# EAGLE design DAC (EAGLE 7.2.0)
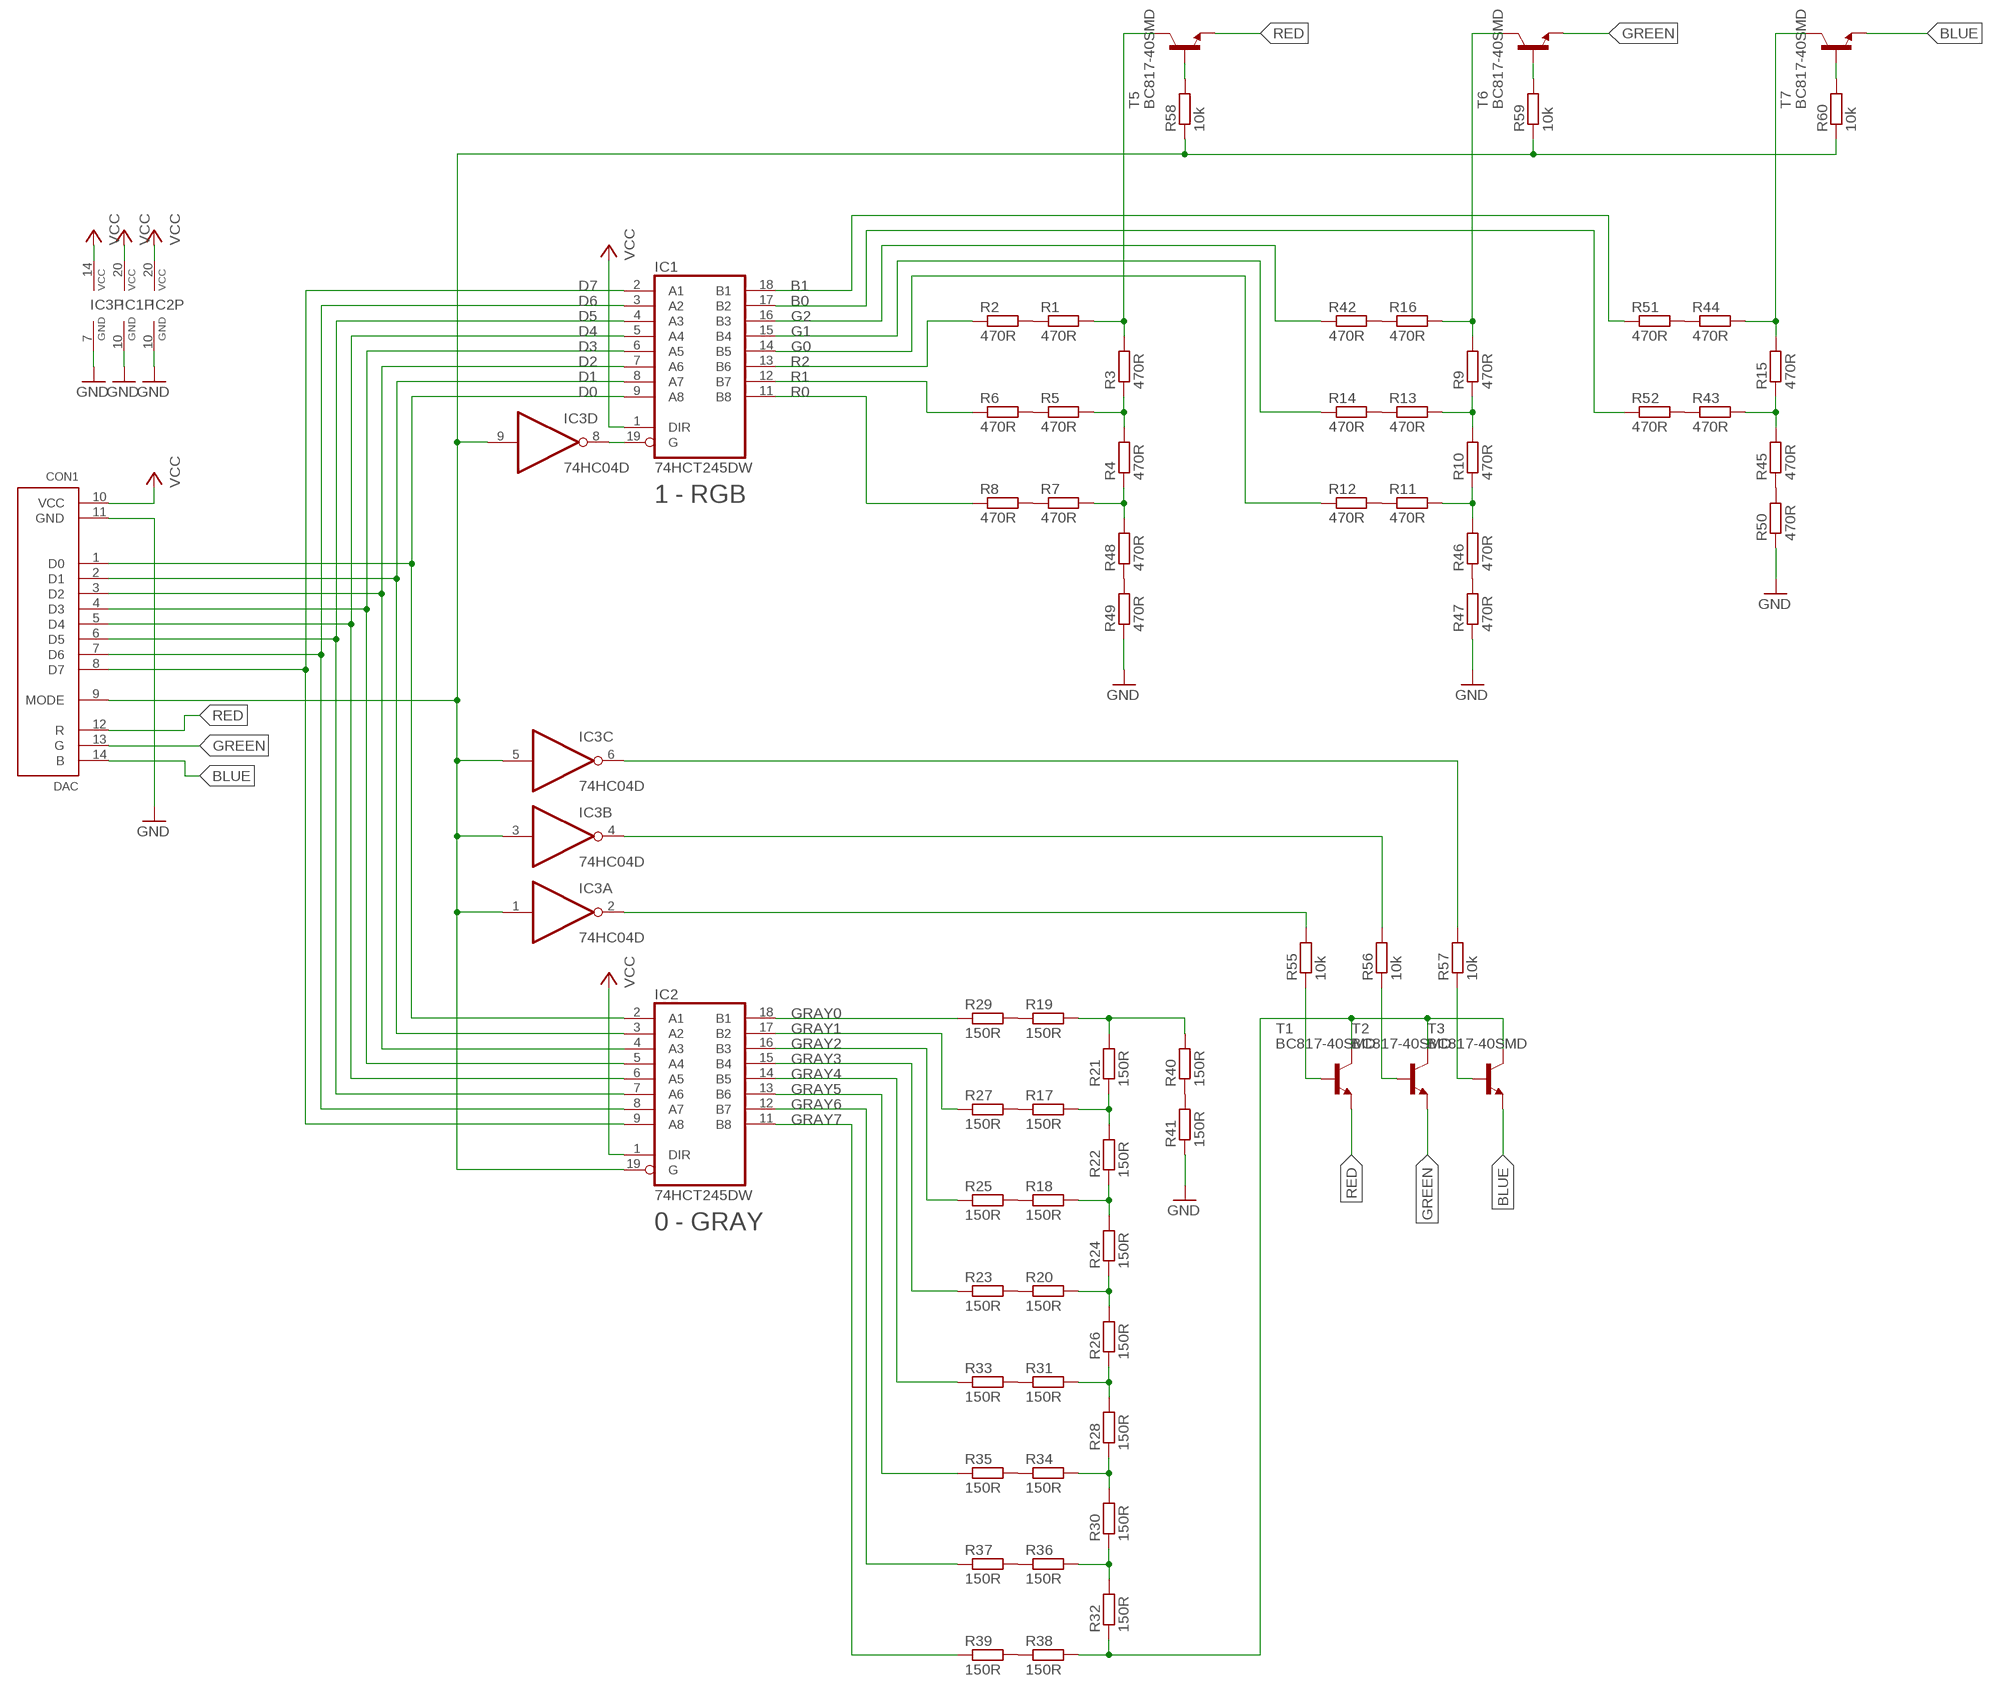
[diagram p0: schematic, sheet 1]

## Parts
CON1  DAC  [DAC_CON]
IC1  74HCT245DW  [SO20W]
IC2  74HCT245DW  [SO20W]
IC3  74HC04D  [SO14]
R1  470R  R-EU_R0603  [R0603]
R2  470R  R-EU_R0603  [R0603]
R3  470R  R-EU_R0603  [R0603]
R4  470R  R-EU_R0603  [R0603]
R5  470R  R-EU_R0603  [R0603]
R6  470R  R-EU_R0603  [R0603]
R7  470R  R-EU_R0603  [R0603]
R8  470R  R-EU_R0603  [R0603]
R9  470R  R-EU_R0603  [R0603]
R10  470R  R-EU_R0603  [R0603]
R11  470R  R-EU_R0603  [R0603]
R12  470R  R-EU_R0603  [R0603]
R13  470R  R-EU_R0603  [R0603]
R14  470R  R-EU_R0603  [R0603]
R15  470R  R-EU_R0603  [R0603]
R16  470R  R-EU_R0603  [R0603]
R17  150R  R-EU_R0603  [R0603]
R18  150R  R-EU_R0603  [R0603]
R19  150R  R-EU_R0603  [R0603]
R20  150R  R-EU_R0603  [R0603]
R21  150R  R-EU_R0603  [R0603]
R22  150R  R-EU_R0603  [R0603]
R23  150R  R-EU_R0603  [R0603]
R24  150R  R-EU_R0603  [R0603]
R25  150R  R-EU_R0603  [R0603]
R26  150R  R-EU_R0603  [R0603]
R27  150R  R-EU_R0603  [R0603]
R28  150R  R-EU_R0603  [R0603]
R29  150R  R-EU_R0603  [R0603]
R30  150R  R-EU_R0603  [R0603]
R31  150R  R-EU_R0603  [R0603]
R32  150R  R-EU_R0603  [R0603]
R33  150R  R-EU_R0603  [R0603]
R34  150R  R-EU_R0603  [R0603]
R35  150R  R-EU_R0603  [R0603]
R36  150R  R-EU_R0603  [R0603]
R37  150R  R-EU_R0603  [R0603]
R38  150R  R-EU_R0603  [R0603]
R39  150R  R-EU_R0603  [R0603]
R40  150R  R-EU_R0603  [R0603]
R41  150R  R-EU_R0603  [R0603]
R42  470R  R-EU_R0603  [R0603]
R43  470R  R-EU_R0603  [R0603]
R44  470R  R-EU_R0603  [R0603]
R45  470R  R-EU_R0603  [R0603]
R46  470R  R-EU_R0603  [R0603]
R47  470R  R-EU_R0603  [R0603]
R48  470R  R-EU_R0603  [R0603]
R49  470R  R-EU_R0603  [R0603]
R50  470R  R-EU_R0603  [R0603]
R51  470R  R-EU_R0603  [R0603]
R52  470R  R-EU_R0603  [R0603]
R55  10k  R-EU_R0603  [R0603]
R56  10k  R-EU_R0603  [R0603]
R57  10k  R-EU_R0603  [R0603]
R58  10k  R-EU_R0603  [R0603]
R59  10k  R-EU_R0603  [R0603]
R60  10k  R-EU_R0603  [R0603]
T1  BC817-40SMD  [SOT23-BEC]
T2  BC817-40SMD  [SOT23-BEC]
T3  BC817-40SMD  [SOT23-BEC]
T5  BC817-40SMD  [SOT23-BEC]
T6  BC817-40SMD  [SOT23-BEC]
T7  BC817-40SMD  [SOT23-BEC]

## Nets
B0: IC1.17(B2) R52.1
B1: IC1.18(B1) R51.1
BLUE: CON1.14(B) T3.E T7.E
D0: CON1.1(D0) IC1.9(A8) IC2.2(A1)
D1: CON1.2(D1) IC1.8(A7) IC2.3(A2)
D2: CON1.3(D2) IC1.7(A6) IC2.4(A3)
D3: CON1.4(D3) IC1.6(A5) IC2.5(A4)
D4: CON1.5(D4) IC1.5(A4) IC2.6(A5)
D5: CON1.6(D5) IC1.4(A3) IC2.7(A6)
D6: CON1.7(D6) IC1.3(A2) IC2.8(A7)
D7: CON1.8(D7) IC1.2(A1) IC2.9(A8)
DAC_BLUE: R15.2 R44.2 T7.C
DAC_GRAY: R32.1 R38.2 T1.C T2.C T3.C
DAC_GREEN: R9.2 R16.2 T6.C
DAC_RED: R1.2 R3.2 T5.C
G0: IC1.14(B5) R12.1
G1: IC1.15(B4) R14.1
G2: IC1.16(B3) R42.1
GND: CON1.11(GND) IC1.10(GND) IC2.10(GND) IC3.7(P:GND) R41.1 R47.1 R49.1 R50.1
GRAY0: IC2.18(B1) R29.1
GRAY1: IC2.17(B2) R27.1
GRAY2: IC2.16(B3) R25.1
GRAY3: IC2.15(B4) R23.1
GRAY4: IC2.14(B5) R33.1
GRAY5: IC2.13(B6) R35.1
GRAY6: IC2.12(B7) R37.1
GRAY7: IC2.11(B8) R39.1
GREEN: CON1.13(G) T2.E T6.E
N$1: R9.1 R10.2 R13.2
N$2: R3.1 R4.2 R5.2
N$3: R4.1 R7.2 R48.2
N$4: R10.1 R11.2 R46.2
N$5: R15.1 R43.2 R45.2
N$6: R20.1 R23.2
N$7: R17.2 R21.1 R22.2
N$8: R18.2 R22.1 R24.2
N$9: R20.2 R24.1 R26.2
N$10: R26.1 R28.2 R31.2
N$11: R28.1 R30.2 R34.2
N$12: R30.1 R32.2 R36.2
N$14: R18.1 R25.2
N$15: R17.1 R27.2
N$16: R19.1 R29.2
N$17: R31.1 R33.2
N$18: R34.1 R35.2
N$19: R36.1 R37.2
N$20: R38.1 R39.2
N$21: R40.1 R41.2
N$22: R1.1 R2.2
N$23: R5.1 R6.2
N$24: R7.1 R8.2
N$25: R11.1 R12.2
N$26: R13.1 R14.2
N$27: R16.1 R42.2
N$28: R46.1 R47.2
N$29: R48.1 R49.2
N$30: R45.1 R50.2
N$31: R44.1 R51.2
N$32: R43.1 R52.2
N$33: R19.2 R21.2 R40.2
N$49: IC1.19(G) IC3.8(D:O)
N$50: IC3.2(A:O) R55.2
N$51: R58.2 T5.B
N$52: IC3.4(B:O) R56.2
N$53: R59.2 T6.B
N$54: R55.1 T1.B
N$55: R56.1 T2.B
N$56: R57.1 T3.B
N$57: R60.2 T7.B
N$58: CON1.9(MODE) IC2.19(G) IC3.1(A:I) IC3.3(B:I) IC3.5(C:I) IC3.9(D:I) R58.1 R59.1 R60.1
N$59: IC3.6(C:O) R57.2
R0: IC1.11(B8) R8.1
R1: IC1.12(B7) R6.1
R2: IC1.13(B6) R2.1
RED: CON1.12(R) T1.E T5.E
VCC: CON1.10(VCC) IC1.1(DIR) IC1.20(VCC) IC2.1(DIR) IC2.20(VCC) IC3.14(P:VCC)
Unconnected: IC3.10(E:O) IC3.11(E:I) IC3.12(F:O) IC3.13(F:I)

## Notes on the sheet
- 1 - RGB
- 0 - GRAY

## Library data of the parts
CON1 = DAC connector:DAC
IC1 IC2 = 74xx-eu:74*245: Octal BUS TRANSCEIVER, 3-state
IC3 = 74xx-eu:74*04: Hex INVERTER
R1-R52 R55-R60 = rcl:R-EU_: RESISTOR, European symbol
T1-T3 T5-T7 = transistor-npn:BC817*: NPN Transistor

## Board
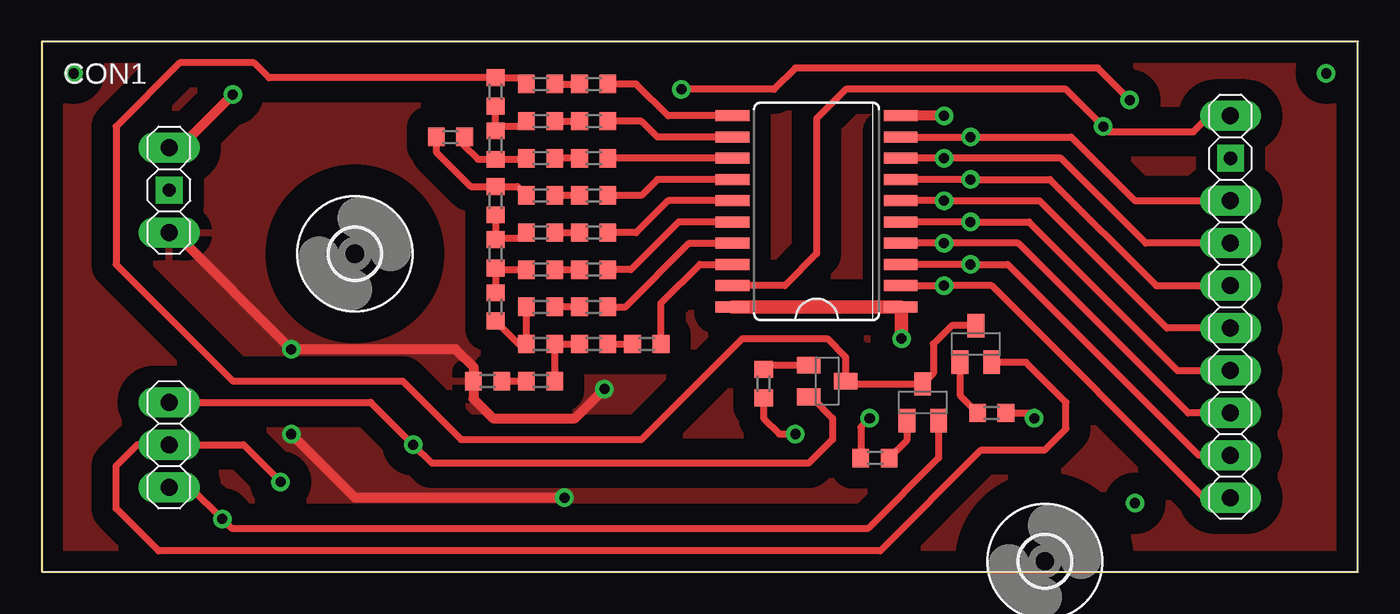
[diagram p1: board, top side]
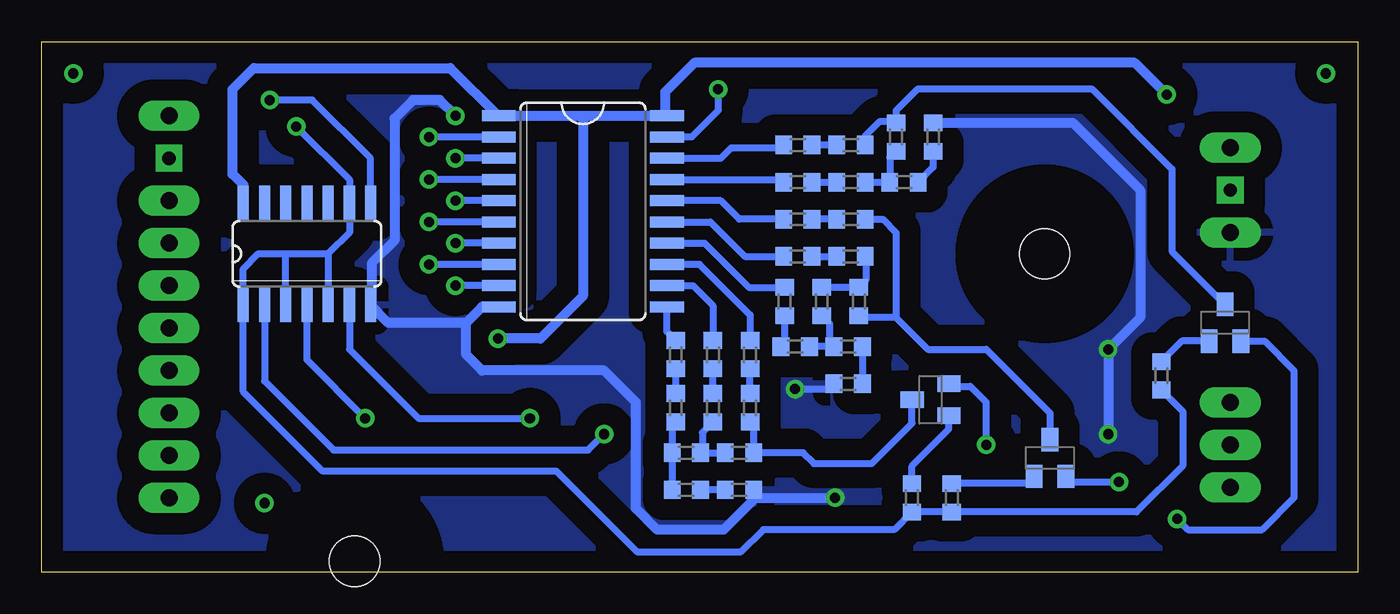
[diagram p2: board, bottom side, seen from below]

Size 78.73 x 31.74 mm. Coordinates in mm from the lower left corner, seen from the top.
Outline: 0,0 78.73,0 78.73,31.74 0,31.74 0,0
Copper layers (1*16): Top 0.035mm / dielectric 1.5mm / Bottom 0.035mm
Design rules "Aroidzap_DesignRules20mil": minimum track width 16mil, minimum drill 0.6mm, track to track 20mil, track to pad 20mil, pad to pad 20mil, via to via 20mil, smd to smd 16mil, copper to edge 20mil, drill to drill 40mil, minimum pad ring 16mil, minimum via ring 10mil, stop-mask expansion 4mil, vias tented up to drill 0mil, thermal gap 30mil

### Footprints (pad centres in the part's own frame; a part is rotated, then mirrored left to right if it is on the bottom)
DAC_CON = drill 1.016 long: 1 31.75,-11.43; 2 31.75,-8.89; 3 31.75,-6.35; 4 31.75,-3.81; 5 31.75,-1.27; 6 31.75,1.27; 7 31.75,3.81; 8 31.75,6.35; 9 31.75,11.43; 10 -31.75,9.525; 11 -31.75,4.445; 12 -31.75,-5.715; 13 -31.75,-8.255; 14 -31.75,-10.795 | drill 0.8 square: NC1 31.75,8.89; NC2 -31.75,6.985
SO20W = smd 0.66 x 2.032: 1 -5.715,-5.029; 2 -4.445,-5.029; 3 -3.175,-5.029; 4 -1.905,-5.029; 5 -0.635,-5.029; 6 0.635,-5.029; 7 1.905,-5.029; 8 3.175,-5.029; 9 4.445,-5.029; 10 5.715,-5.029; 11 5.715,5.029; 12 4.445,5.029; 13 3.175,5.029; 14 1.905,5.029; 15 0.635,5.029; 16 -0.635,5.029; 17 -1.905,5.029; 18 -3.175,5.029; 19 -4.445,5.029; 20 -5.715,5.029
SO14 = smd 0.66 x 2.032: 1 -3.81,-3.073; 2 -2.54,-3.073; 3 -1.27,-3.073; 4 0,-3.073; 5 1.27,-3.073; 6 2.54,-3.073; 7 3.81,-3.073; 8 3.81,3.073; 9 2.54,3.073; 10 1.27,3.073; 11 0,3.073; 12 -1.27,3.073; 13 -2.54,3.073; 14 -3.81,3.073
R0603 = smd 1 x 1.1: 1 -0.85,0; 2 0.85,0
SOT23-BEC = smd 1 x 1.4: B -0.95,-1.1; C 0,1.1; E 0.95,-1.1
3,0 = hole 3: 0,0

### Placement (x,y rotation side)
CON1  39.37,15.88 0 top
IC1  46.35,21.59 270 bottom
IC2  46.35,21.59 90 top
IC3  62.87,19.05 0 bottom
R1  36.35,9.84 270 bottom
R2  36.35,13.02 270 bottom
R3  36.99,7.14 0 bottom
R4  40.16,7.14 0 bottom
R5  38.58,9.84 270 bottom
R6  38.58,13.02 270 bottom
R7  40.8,9.84 270 bottom
R8  40.8,13.02 270 bottom
R9  29.84,16.19 270 bottom
R10  32.07,16.19 90 bottom
R11  33.66,13.49 0 bottom
R12  34.29,16.19 270 bottom
R13  30.32,18.89 0 bottom
R14  33.5,18.89 0 bottom
R15  27.62,26.04 90 bottom
R16  30.32,21.11 0 bottom
R17  29.84,15.88 180 top
R18  29.84,18.1 180 top
R19  33.02,13.65 180 top
R20  29.84,20.32 180 top
R21  29.84,13.65 0 top
R22  27.15,15.88 270 top
R23  33.02,20.32 180 top
R24  27.15,19.05 270 top
R25  33.02,18.1 180 top
R26  27.15,22.23 270 top
R27  33.02,15.88 180 top
R28  24.45,26.04 180 top
R29  36.2,13.65 180 top
R30  27.15,25.56 270 top
R31  29.84,22.54 180 top
R32  27.15,28.73 270 top
R33  33.02,22.54 180 top
R34  29.84,24.77 180 top
R35  33.02,24.77 180 top
R36  29.84,26.99 180 top
R37  33.02,26.99 180 top
R38  29.84,29.21 180 top
R39  33.02,29.21 180 top
R40  29.84,11.43 0 top
R41  26.67,11.43 0 top
R42  33.5,21.11 0 bottom
R43  30.32,23.34 0 bottom
R44  30.32,25.56 0 bottom
R45  27.15,23.34 180 bottom
R46  30.48,13.49 180 bottom
R47  30.48,11.27 0 bottom
R48  40.16,4.92 180 bottom
R49  36.99,4.92 180 bottom
R50  25.4,26.04 270 bottom
R51  33.5,25.56 0 bottom
R52  33.5,23.34 0 bottom
R55  43.18,11.27 270 top
R56  56.83,9.53 0 top
R57  49.85,6.83 180 top
R58  26.67,4.45 90 bottom
R59  24.29,4.45 90 bottom
R60  11.75,11.75 90 bottom
T1  46.99,11.43 270 top
T2  55.88,13.65 0 top
T3  52.7,10.16 0 top
T5  25.56,10.32 90 bottom
T6  18.41,6.83 0 bottom
T7  7.94,14.92 0 bottom
U$1  [3,0]  18.73,19.05 0 top
U$2  [3,0]  60.01,0.64 0 top

### Tracks (layer width: path | path; a pad name or v marks a point on that pad's centre or on a via)
B0
  Bottom 0.406: IC1.17 34.51,23.5 R52.1
B1
  Bottom 0.406: IC1.18 38.1,24.77 37.47,25.4 34.51,25.4 R51.1
BLUE  (via drill 0.6)
  Top 0.406: T3.E 53.66,6.82 49.45,2.62 11.35,2.62 v10.79,3.17 8.89,5.08 CON1.14
  Bottom 0.406: T7.E 5.57,13.82 3.81,12.06 3.81,4.45 5.71,2.54 10.16,2.54 v10.79,3.17
D0  (via drill 0.6)
  Top 0.406: IC1.9 v53.98,17.14 56.83,17.14 69.53,4.45 CON1.1
  Bottom 0.406: IC1.9 v53.98,17.14
D1  (via drill 0.6)
  Top 0.406: CON1.2 69.22,6.99 57.78,18.41 v55.56,18.41 IC1.8
  Bottom 0.406: IC1.8 v55.56,18.41
D2  (via drill 0.6)
  Top 0.406: CON1.3 68.58,9.53 58.42,19.68 v53.98,19.68 IC1.7
  Bottom 0.406: IC1.7 v53.98,19.68
D3  (via drill 0.6)
  Top 0.406: IC1.6 v55.56,20.95 59.05,20.95 67.94,12.06 CON1.4
  Bottom 0.406: IC1.6 v55.56,20.95
D4  (via drill 0.6)
  Top 0.406: CON1.5 67.31,14.61 59.69,22.23 v53.98,22.23 IC1.5
  Bottom 0.406: IC1.5 v53.98,22.23
D5  (via drill 0.6)
  Top 0.406: IC1.4 v55.56,23.5 60.33,23.5 66.67,17.14 CON1.6
  Bottom 0.406: IC1.4 v55.56,23.5
D6  (via drill 0.6)
  Top 0.406: CON1.7 66.04,19.68 60.96,24.77 v53.98,24.77 IC1.3
  Bottom 0.406: IC1.3 v53.98,24.77
D7  (via drill 0.6)
  Top 0.406: IC1.2 v55.56,26.04 61.59,26.04 65.41,22.23 CON1.8
  Bottom 0.406: IC1.2 v55.56,26.04
DAC_BLUE
  Bottom 0.406: R44.2 29.47,26.09 28.57,26.99 27.73,26.99 R15.2 27.62,27.62 26.35,28.89 15.88,28.89 11.11,24.13 11.11,19.2 T7.C
DAC_GRAY
  Top 0.406: T2.C 54.44,14.75 53.34,13.65 53.34,11.89 T3.C 48.6,11.26 48.26,11.6 T1.C 48.09,12.87 46.99,13.97 41.91,13.97 35.88,7.94 25.08,7.94 21.59,11.43 11.43,11.43 4.45,18.41 4.45,26.67 8.26,30.48 12.7,30.48 13.6,29.58 R32.1 28.62,29.58 R38.2
DAC_GREEN
  Bottom 0.406: 28.89,21.11 R16.2 28.42,21.11 27.62,20.32 27.62,15.24 | 27.62,15.24 29.74,15.24 R9.2 | 27.62,15.24 25.72,13.34 22.23,13.34 18.41,9.53 T6.C
DAC_RED
  Bottom 0.406: R1.2 36.14,8.78 R3.2 33.18,7.14 32.53,6.5 29.06,6.5 26.66,8.9 T5.C
G0
  Bottom 0.406: IC1.14 39.07,19.68 36.43,17.04 R12.1
G1
  Bottom 0.406: 34.51,19.05 R14.1 36.67,18.89 38.73,20.95 IC1.15
G2
  Bottom 0.406: R42.1 36.99,21.11 38.1,22.23 IC1.16
GND  (via drill 0.6)
  Top 0.61: v53.98,27.3 IC2.10 | v31.27,4.45 18.73,4.45 v14.92,8.26 | CON1.11 7.94,20.32 v14.92,13.34 24.77,13.34 25.82,12.28 R41.1 25.82,10.38 26.99,9.21 31.91,9.21 v33.66,10.95
  Bottom 0.406: 58.95,15.88 IC3.7 | v33.66,10.95 31.65,10.95 R47.1
  Bottom 0.61: 58.95,15.88 58.95,18.52 57.63,19.84 57.63,27.15 56.52,28.26 54.93,28.26 v53.98,27.3 | R50.1 17.04,26.89 13.02,22.86 13.02,15.24 v14.92,13.34 v14.92,8.26 | IC1.10 52.39,15.88 53.34,14.92 | 53.34,14.92 58,14.92 IC3.7 | 53.34,14.92 53.34,13.02 52.39,12.06 45.09,12.06 43.18,10.16 43.18,3.81 41.91,2.54 37.94,2.54 36.04,4.45 | R49.1 36.04,5.02 | 36.04,5.02 35.98,5.08 | 36.04,5.02 36.04,4.45 | 36.04,4.45 v31.27,4.45 | 31.27,11.21 R47.1
  pour Top (isolate 1.27): 0,31.75 78.74,31.75 78.74,0 0,0
  pour Bottom (isolate 1.27): 0,31.75 78.74,31.75 78.74,0 0,0
GRAY0
  Top 0.406: IC2.18 39.37,18.41 37.05,16.09 R29.1
GRAY1
  Top 0.406: R27.1 34.92,15.88 38.73,19.68 IC2.17
GRAY2
  Top 0.406: IC2.16 38.1,20.95 35.24,18.1 R25.1
GRAY3
  Top 0.406: IC2.15 37.47,22.23 35.56,20.32 R23.1
GRAY4
  Top 0.406: IC2.14 36.83,23.5 35.88,22.54 R33.1
GRAY5
  Top 0.406: IC2.13 R35.1
GRAY6
  Top 0.406: IC2.12 36.83,26.04 35.88,26.99 R37.1
GRAY7
  Top 0.406: IC2.11 37.47,27.3 35.56,29.21 R39.1
GREEN  (via drill 0.6)
  Top 0.406: T2.E 58.88,12.55 61.28,10.16 61.28,8.57 60.01,7.3 56.2,7.3 50.16,1.27 6.99,1.27 4.45,3.81 4.45,6.35 5.71,7.62 CON1.13 12.06,7.62 v14.29,5.4
  Bottom 0.406: 14.28,5.41 v14.29,5.4 17.14,5.4 T6.E
N$1
  Bottom 0.406: R13.2 29.43,18.84 29.43,17.46 R9.1 R10.2
N$2
  Bottom 0.406: R3.1 R4.2 39.21,7.25 39.21,8.36 R5.2
N$3
  Bottom 0.406: R7.2 41.01,8.78 R4.1 R48.2
N$4
  Bottom 0.406: R11.2 R46.2 31.33,13.71 31.59,13.97 31.59,14.87 R10.1
N$5
  Bottom 0.406: R43.2 29.37,23.44 29.27,23.34 R45.2 28,24.81 R15.1
N$6
  Top 0.406: R20.1 R23.2
N$7
  Top 0.406: 28.89,15.88 R17.2 R21.1 28.52,13.65 R22.2
N$8
  Top 0.406: R18.2 27.25,18.1 R24.2 R22.1
N$9
  Top 0.406: R26.2 R24.1 27.2,19.9 27.3,20 28.68,20 R20.2
N$10
  Top 0.406: R28.2 23.6,25.14 25.66,23.07 R26.1 28.46,23.07 R31.2
N$11
  Top 0.406: R28.1 25.24,25.98 25.24,25.56 26.09,24.71 R30.2 28.94,24.71 R34.2
N$12
  Top 0.406: R32.2 R30.1 27.41,26.67 28.68,26.67 R36.2
N$14
  Top 0.406: R18.1 R25.2
N$15
  Top 0.406: R27.2 R17.1
N$16
  Top 0.406: R19.1 R29.2
N$17
  Top 0.406: R33.2 R31.1
N$18
  Top 0.406: R35.2 R34.1
N$19
  Top 0.406: R36.1 R37.2
N$20
  Top 0.406: R38.1 R39.2
N$21
  Top 0.406: R41.2 R40.1
N$22
  Bottom 0.406: R1.1 R2.2
N$23
  Bottom 0.406: R5.1 R6.2
N$24
  Bottom 0.406: R7.1 R8.2
N$25
  Bottom 0.406: R12.2 34.29,13.71 R11.1
N$26
  Bottom 0.406: R14.2 R13.1
N$27
  Bottom 0.406: R16.1 R42.2
N$28
  Bottom 0.406: R46.1 R47.2
N$29
  Bottom 0.406: R49.2 R48.1
N$30
  Bottom 0.406: R50.2 25.4,24.23 R45.1
N$31
  Bottom 0.406: R44.1 R51.2
N$32
  Bottom 0.406: R52.2 R43.1
N$33
  Top 0.406: R19.2 R21.2 R40.2
N$35  (via drill 0.6)
  other vias: 1.91,29.84
N$36  (via drill 0.6)
  other vias: 65.41,4.13
N$37  (via drill 0.6)
  other vias: 76.83,29.84
N$49  (via drill 0.6)
  Top 0.406: v65.09,28.26 63.18,30.16 45.09,30.16 43.81,28.89 v38.26,28.89
  Bottom 0.406: 59.05,21.59 IC3.8 59.05,24.77 62.55,28.26 v65.09,28.26 | IC1.19 39.85,26.04 38.26,27.62 v38.26,28.89
N$50  (via drill 0.6)
  Top 0.406: R55.2 43.18,9.21 44.13,8.26 v45.09,8.26
  Bottom 0.406: IC3.2 65.41,11.43 61.28,7.3 46.04,7.3 v45.09,8.26
N$51
  Bottom 0.406: R58.2 26.67,6.35 24.46,8.56 T5.B
N$52  (via drill 0.6)
  Top 0.406: R56.2 59.05,9.53 v59.37,9.21
  Bottom 0.406: v59.37,9.21 62.87,12.7 IC3.4
N$53
  Bottom 0.406: R59.2 19.48,5.29 19.48,5.61 T6.B
N$54
  Top 0.406: T1.B 43.18,12.38 R55.1
N$55
  Top 0.406: T2.B 54.93,10.58 R56.1
N$56
  Top 0.406: T3.B 51.76,7.88 R57.1
N$57
  Bottom 0.406: T7.B 10.52,13.82 R60.2
N$58  (via drill 0.6)
  Top 0.406: IC2.19 44.45,17.14 46.35,19.05 46.35,27.15 48.1,28.89 61.28,28.89 v63.5,26.67 63.82,26.35 68.9,26.35 69.85,27.3 CON1.9
  Bottom 0.406: 61.59,19.05 60.33,20.32 IC3.9 60.33,23.5 v63.5,26.67 | 61.59,19.05 IC3.5 | IC3.3 64.14,19.05 | 64.14,19.05 61.59,19.05 | 64.14,19.05 65.78,19.05 66.67,18.15 IC3.1 66.67,10.79 61.91,6.03 47.94,6.03 43.12,1.21 36.89,1.21 35.56,2.54 27.73,2.54 R58.1 R59.1 13.23,3.6 10.48,6.35 10.48,9.63 R60.1
N$59  (via drill 0.6)
  Top 0.406: R57.2 49,8.68 v49.53,9.21
  Bottom 0.406: IC3.6 60.33,13.34 56.2,9.21 v49.53,9.21
R0
  Bottom 0.406: R8.1 41.33,14.39 IC1.11
R1
  Bottom 0.406: IC1.12 39.76,17.14 38.58,15.96 R6.1
R2
  Bottom 0.406: IC1.13 39.37,18.41 36.35,15.4 R2.1
RED  (via drill 0.6)
  Top 0.406: T1.E 46.03,10.48 47.31,9.21 47.31,7.94 45.88,6.51 23.34,6.51 v22.23,7.62 19.68,10.16 CON1.12
  Bottom 0.406: T5.E 24.3,11.11 23.18,11.11 22.23,10.16 v22.23,7.62
VCC  (via drill 0.6)
  Top 0.406: 51.44,15.82 IC2.1
  Top 0.61: CON1.10 8.26,25.4 v11.43,28.57
  Top 0.813: v51.44,13.97 51.44,15.82 | IC2.20 IC2.1
  Bottom 0.406: 51.44,27.3 IC1.1 | 41.43,27.41 IC1.20
  Bottom 0.61: 46.35,27.3 IC1.20 | IC1.1 46.35,27.3 | 46.35,27.3 46.35,16.51 48.9,13.97 v51.44,13.97 | 51.44,27.3 54.29,30.16 66.04,30.16 67.31,28.89 67.31,23.81 66.67,23.18 IC3.14 | 41.43,27.41 41.43,28.73 39.69,30.48 13.34,30.48 v11.43,28.57

### Text on the board
tValues: 150R
bValues: 470R